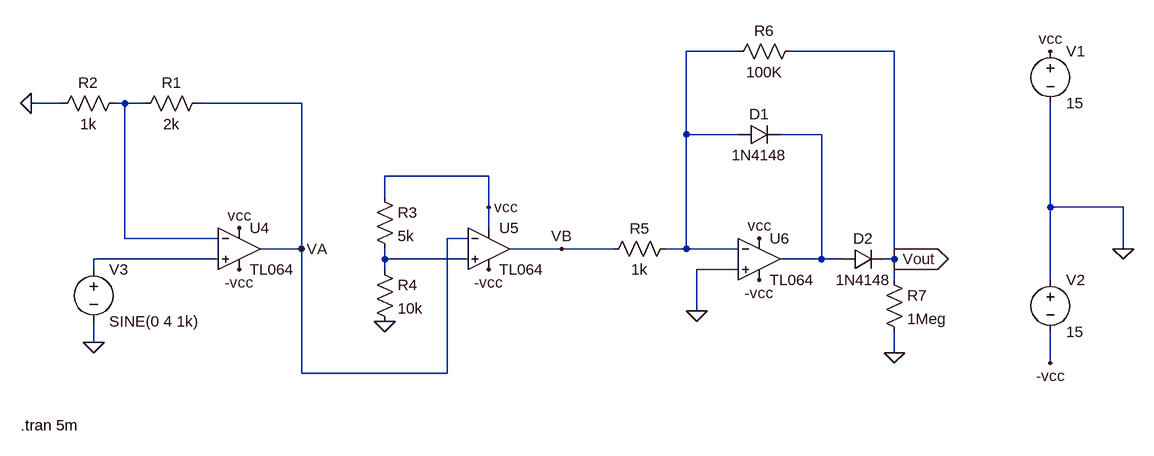
[diagram p0: schematic Op-Amp Based Over-Voltage Protection with Hysteresis.asc]
Op-Amp Based Over-Voltage Protection with Hysteresis.asc, the LTspice schematic file:
Version 4
SHEET 1 1828 680
WIRE 832 -160 752 -160
WIRE 1072 -160 912 -160
WIRE -208 -80 -256 -80
WIRE -112 -80 -128 -80
WIRE -80 -80 -112 -80
WIRE 160 -80 0 -80
WIRE 752 -32 752 -160
WIRE 832 -32 752 -32
WIRE 960 -32 896 -32
WIRE 448 32 288 32
WIRE 288 64 288 32
WIRE 448 80 448 32
WIRE 1312 80 1312 -80
WIRE 1424 80 1312 80
WIRE 448 112 448 80
WIRE -112 128 -112 -80
WIRE 32 128 -112 128
WIRE 416 128 384 128
WIRE 160 144 160 -80
WIRE 160 144 96 144
WIRE 560 144 480 144
WIRE 640 144 560 144
WIRE 752 144 752 -32
WIRE 752 144 720 144
WIRE 832 144 752 144
WIRE 1424 144 1424 80
WIRE 32 160 -160 160
WIRE 288 160 288 144
WIRE 416 160 288 160
WIRE 960 160 960 -32
WIRE 960 160 896 160
WIRE 992 160 960 160
WIRE 1072 160 1072 -160
WIRE 1072 160 1056 160
WIRE -160 176 -160 160
WIRE 288 176 288 160
WIRE 832 176 768 176
WIRE 1072 192 1072 160
WIRE 1312 192 1312 80
WIRE 768 240 768 176
WIRE -160 288 -160 256
WIRE 1072 304 1072 272
WIRE 1312 320 1312 272
WIRE 160 336 160 144
WIRE 384 336 384 128
WIRE 384 336 160 336
FLAG 1424 144 0
FLAG 1312 320 -vcc
FLAG 1312 -160 vcc
FLAG -160 288 0
FLAG -256 -80 0
FLAG 64 112 vcc
FLAG 64 176 -vcc
FLAG 448 176 -vcc
FLAG 288 256 0
FLAG 448 80 vcc
FLAG 864 128 vcc
FLAG 864 192 -vcc
FLAG 768 240 0
FLAG 1072 304 0
FLAG 160 144 VA
FLAG 560 144 VB
FLAG 1072 160 Vout
IOPIN 1072 160 Out
SYMBOL voltage 1312 -176 R0
SYMATTR InstName V1
SYMATTR Value 15
SYMBOL voltage 1312 176 R0
WINDOW 123 0 0 Left 0
WINDOW 39 0 0 Left 0
SYMATTR InstName V2
SYMATTR Value 15
SYMBOL voltage -160 160 R0
WINDOW 123 0 0 Left 0
WINDOW 39 0 0 Left 0
SYMATTR InstName V3
SYMATTR Value SINE(0 4 1k)
SYMBOL res -112 -96 R90
WINDOW 0 0 56 VBottom 2
WINDOW 3 32 56 VTop 2
SYMATTR InstName R2
SYMATTR Value 1k
SYMBOL res 16 -96 R90
WINDOW 0 0 56 VBottom 2
WINDOW 3 32 56 VTop 2
SYMATTR InstName R1
SYMATTR Value 2k
SYMBOL res 272 48 R0
SYMATTR InstName R3
SYMATTR Value 5k
SYMBOL res 272 160 R0
SYMATTR InstName R4
SYMATTR Value 10k
SYMBOL res 736 128 R90
WINDOW 0 0 56 VBottom 2
WINDOW 3 32 56 VTop 2
SYMATTR InstName R5
SYMATTR Value 1k
SYMBOL diode 832 -16 R270
WINDOW 0 32 32 VTop 2
WINDOW 3 0 32 VBottom 2
SYMATTR InstName D1
SYMATTR Value 1N4148
SYMBOL diode 992 176 R270
WINDOW 0 32 32 VTop 2
WINDOW 3 0 32 VBottom 2
SYMATTR InstName D2
SYMATTR Value 1N4148
SYMBOL res 928 -176 R90
WINDOW 0 0 56 VBottom 2
WINDOW 3 32 56 VTop 2
SYMATTR InstName R6
SYMATTR Value 100K
SYMBOL res 1056 176 R0
SYMATTR InstName R7
SYMATTR Value 1Meg
SYMBOL TL064 64 144 R0
SYMATTR InstName U4
SYMBOL TL064 448 144 R0
SYMATTR InstName U5
SYMBOL TL064 864 160 R0
SYMATTR InstName U6
TEXT -272 416 Left 2 !.tran 5m

The netlist it stands for:
* Op-Amp Based Over-Voltage Protection with Hysteresis.asc
V1 vcc 0 15
V2 0 -vcc 15
V3 N004 0 SINE(0 4 1k)
R2 N002 0 1k
R1 VA N002 2k
R3 vcc N005 5k
R4 N005 0 10k
R5 N001 VB 1k
D1 N001 N003 1N4148
D2 N003 Vout 1N4148
R6 Vout N001 100K
R7 Vout 0 1Meg
* U4: TL064 (symbol TL064 not available, pins judged from their places): In+=N004 In-=N002 V+=vcc V-=-vcc OUT=VA
* U5: TL064 (symbol TL064 not available, pins judged from their places): In+=N005 In-=VA V+=vcc V-=-vcc OUT=VB
* U6: TL064 (symbol TL064 not available, pins judged from their places): In+=0 In-=N001 V+=vcc V-=-vcc OUT=N003
.model D D
.lib standard.dio
.tran 5m
.backanno
.end